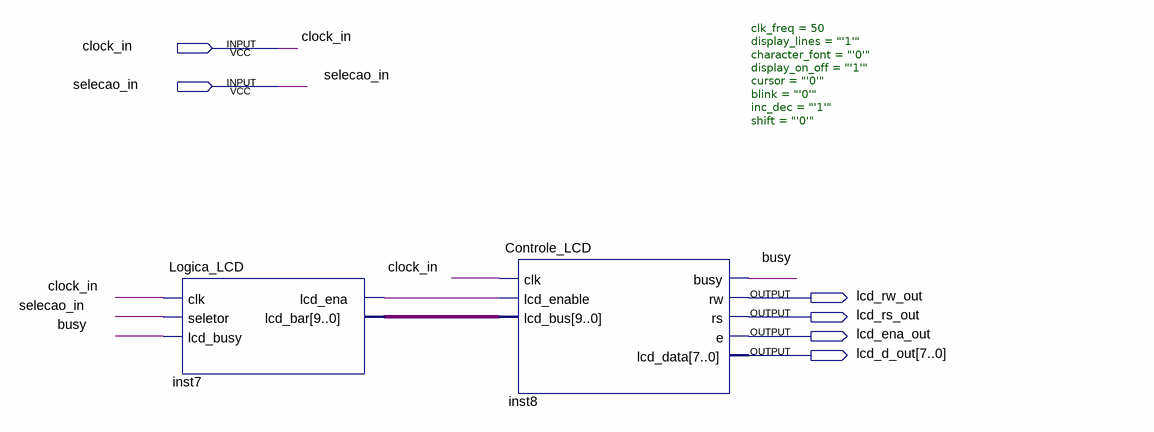
[diagram p0: schematic sheet]
// Quartus schematic bloco_lcd.bdf as structural Verilog: 2 symbols, 6 pins
module bloco_lcd (
  input  clock_in,
  input  selecao_in,
  output lcd_rw_out,
  output lcd_rs_out,
  output lcd_ena_out,
  output [7:0] lcd_d_out
);

  wire busy, inst7_lcd_ena;
  wire [9:0] inst7_lcd_bar;

  Logica_LCD inst7 (
    .clk(clock_in), .seletor(selecao_in), .lcd_busy(busy), .lcd_ena(inst7_lcd_ena), .lcd_bar(inst7_lcd_bar));
  Controle_LCD #(.clk_freq(50), .display_lines("'1'"), .character_font("'0'"), .display_on_off("'1'"), .cursor("'0'"), .blink("'0'"), .inc_dec("'1'"), .shift("'0'")) inst8 (
    .clk(clock_in), .lcd_enable(inst7_lcd_ena), .lcd_bus(inst7_lcd_bar), .busy(busy), .rw(lcd_rw_out),
    .rs(lcd_rs_out), .e(lcd_ena_out), .lcd_data(lcd_d_out));
endmodule
